# EAGLE design rotary_encoder_1_0 (EAGLE 6.6.0)
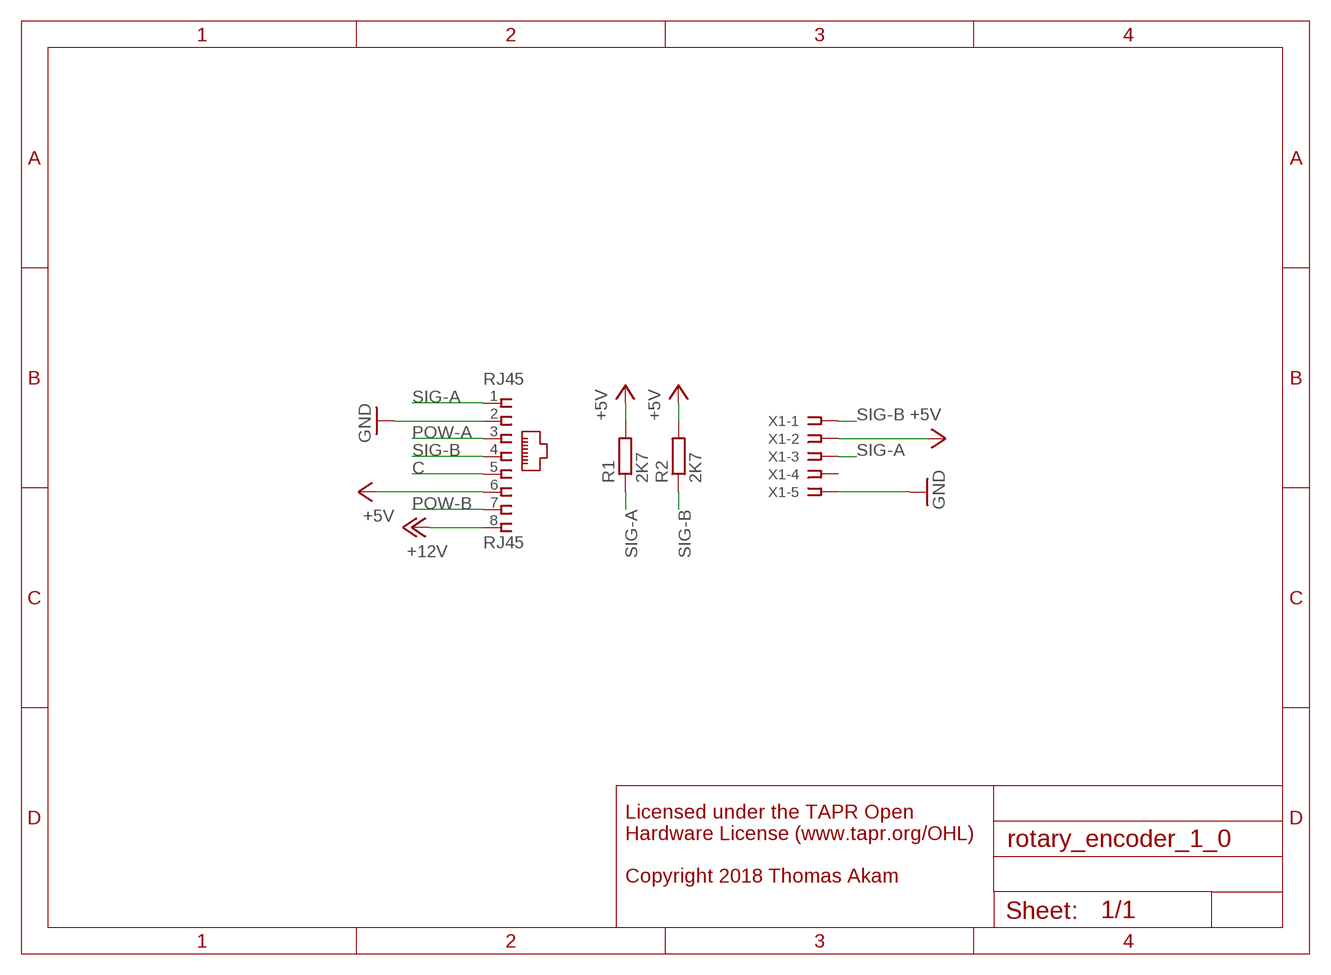
[diagram p0: schematic, sheet 1]

## Parts
R1  2K7  R-EU_M0805  [M0805]
R2  2K7  R-EU_M0805  [M0805]
RJ45  RJ45  RJ45VERTICAL  [RJ45-NO-SHIELD-VERTICAL]
X1  SSW-105-02-S-S-RA  [SSW-105-02-S-S-RA]

## Nets
+5V: R1.2 R2.2 RJ45.6 X1.2
+12V: RJ45.8
C: RJ45.5
GND: RJ45.2 X1.5
POW-A: RJ45.3
POW-B: RJ45.7
SIG-A: R1.1 RJ45.1 X1.3
SIG-B: R2.1 RJ45.4 X1.1
Unconnected: X1.4

## Notes on the sheet
- Licensed under the TAPR Open
  Hardware License (www.tapr.org/OHL)
  
  Copyright 2018 Thomas Akam

## Library data of the parts
R1 R2 = rcl:R-EU_: RESISTOR, European symbol
RJ45 = con-tycoelectronics-vertical_RJ45:RJ45: CORCOM Modular RJ Jacks No Shield Source: www.tycoelectronics.com .. ENG_DS_1654001_1099_RJ_L_0507.pdf
X1 = con-samtec:SSW-105-02-S-S: THROUGH-HOLE .025" SQ POST SOCKET Source: Samtec SSW.pdf; MPN: SSW-105-02-S-S-RA; OC_FARNELL: unknown; OC_NEWARK: 11P9400

## Board
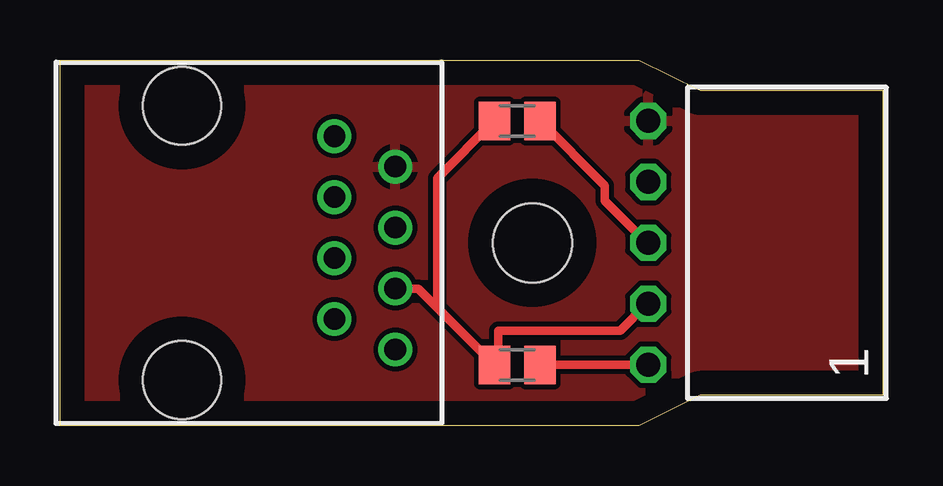
[diagram p1: board, top side]
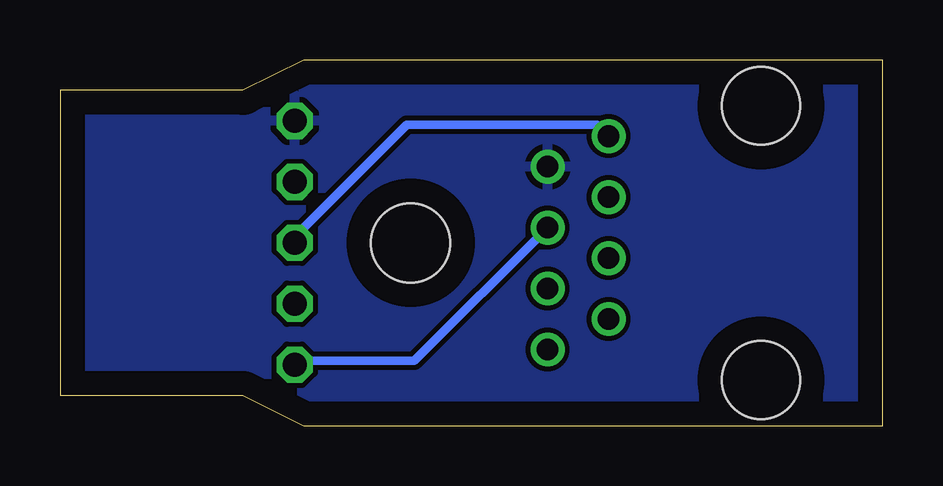
[diagram p2: board, bottom side, seen from below]

Size 34.29 x 15.24 mm. Coordinates in mm from the lower left corner, seen from the top.
Outline: 0,0 0,15.24 24.13,15.24 26.67,13.97 34.29,13.97 34.29,1.27 26.67,1.27 24.13,0 0,0
Copper layers (1*16): Top 0.035mm / dielectric 1.5mm / Bottom 0.035mm
Design rules "default": minimum track width 14mil, minimum drill 24mil, track to track 8mil, track to pad 8mil, pad to pad 8mil, via to via 8mil, smd to smd 8mil, copper to edge 40mil, drill to drill 8mil, minimum pad ring 10mil, minimum via ring 8mil, stop-mask expansion 4mil, vias tented up to drill 0mil, thermal gap 10mil
Holes 3.3 mm at 19.68,7.62

### Footprints (pad centres in the part's own frame; a part is rotated, then mirrored left to right if it is on the bottom)
M0805 = smd 1.3 x 1.6: 1 -0.95,0; 2 0.95,0
RJ45-NO-SHIELD-VERTICAL = drill 0.9 pad 1.4: 1 -4.445,5.08; 2 -3.175,7.62; 3 -1.905,5.08; 4 -0.635,7.62; 5 0.635,5.08; 6 1.905,7.62; 7 3.175,5.08; 8 4.445,7.62 | hole 3.251: -5.715,-1.27; 5.715,-1.27
SSW-105-02-S-S-RA = drill 1 pad 1.5 octagon: 1 -5.08,1.524; 2 -2.54,1.524; 3 0,1.524; 4 2.54,1.524; 5 5.08,1.524

### Placement (x,y rotation side)
R1  19.05,12.7 180 top
R2  19.05,2.54 180 top
RJ45  6.35,7.62 270 top
X1  26.04,7.62 90 top

### Tracks (layer width: path | path; a pad name or v marks a point on that pad's centre or on a via)
+5V
  Top 0.356: 15.64,5 14.92,5.71 RJ45.6 | 15.64,5 R2.2 18.26,2.54 18.26,3.97 23.34,3.97 24.45,5.08 X1.2 | R1.2 15.72,10.32 15.72,5.08 15.64,5
GND
  pour Bottom: 0,0 0,15.24 34.29,15.24 34.29,0
  pour Top: 0,0 0,15.24 34.29,15.24 34.29,0
SIG-A
  Top 0.356: R1.1 22.7,10 22.7,9.37 24.45,7.62 X1.3
  Bottom 0.356: RJ45.1 11.91,12.54 19.84,12.54 24.45,7.94 24.45,7.62 X1.3
SIG-B
  Top 0.356: X1.1 R2.1
  Bottom 0.356: RJ45.4 19.53,2.7 24.29,2.7 24.45,2.54 X1.1

### Text on the board
Document: Licensed under the TAPR Open Hardware License / (www.tapr.org/OHL) / Copyright 2018 Thomas Akam